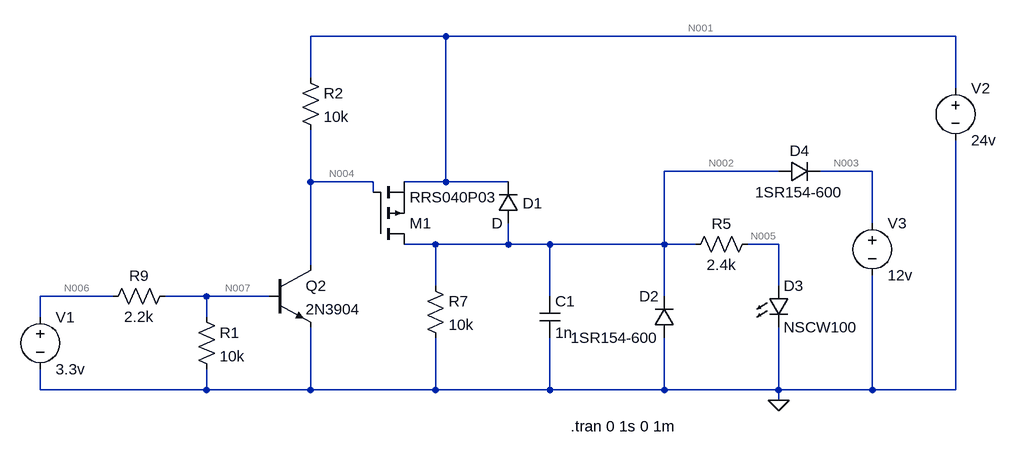
[diagram p0: schematic Prob 3_Before.asc]
Prob 3_Before.asc, the LTspice schematic file:
Version 4
SHEET 1 1096 680
WIRE 176 -112 -32 -112
WIRE 960 -112 176 -112
WIRE -32 -48 -32 -112
WIRE 960 -32 960 -112
WIRE 688 96 512 96
WIRE 832 96 752 96
WIRE -32 112 -32 32
WIRE 64 112 -32 112
WIRE 176 112 176 -112
WIRE 176 112 112 112
WIRE 272 112 176 112
WIRE 64 128 64 112
WIRE 832 176 832 96
WIRE 160 208 112 208
WIRE 272 208 272 176
WIRE 272 208 160 208
WIRE 336 208 272 208
WIRE 512 208 512 96
WIRE 512 208 336 208
WIRE 560 208 512 208
WIRE 688 208 640 208
WIRE -32 240 -32 112
WIRE 160 272 160 208
WIRE 688 272 688 208
WIRE -336 288 -448 288
WIRE -192 288 -256 288
WIRE -96 288 -192 288
WIRE 336 288 336 208
WIRE 512 288 512 208
WIRE -448 320 -448 288
WIRE -192 320 -192 288
WIRE -448 432 -448 400
WIRE -192 432 -192 400
WIRE -192 432 -448 432
WIRE -32 432 -32 336
WIRE -32 432 -192 432
WIRE 160 432 160 352
WIRE 160 432 -32 432
WIRE 336 432 336 352
WIRE 336 432 160 432
WIRE 512 432 512 352
WIRE 512 432 336 432
WIRE 688 432 688 336
WIRE 688 432 512 432
WIRE 832 432 832 256
WIRE 832 432 688 432
WIRE 960 432 960 48
WIRE 960 432 832 432
WIRE 688 448 688 432
FLAG 688 448 0
SYMBOL res -48 -64 R0
SYMATTR InstName R2
SYMATTR Value 10k
SYMBOL res 656 192 R90
WINDOW 0 0 56 VBottom 2
WINDOW 3 32 56 VTop 2
SYMATTR InstName R5
SYMATTR Value 2.4k
SYMBOL voltage -448 304 R0
WINDOW 123 0 0 Left 0
WINDOW 39 0 0 Left 0
SYMATTR InstName V1
SYMATTR Value 3.3v
SYMBOL voltage 960 -48 R0
WINDOW 123 0 0 Left 0
WINDOW 39 0 0 Left 0
SYMATTR InstName V2
SYMATTR Value 24v
SYMBOL voltage 832 160 R0
WINDOW 123 0 0 Left 0
WINDOW 39 0 0 Left 0
SYMATTR InstName V3
SYMATTR Value 12v
SYMBOL pmos 64 208 M180
SYMATTR InstName M1
SYMATTR Value RRS040P03
SYMBOL res 144 256 R0
SYMATTR InstName R7
SYMATTR Value 10k
SYMBOL npn -96 240 R0
SYMATTR InstName Q2
SYMATTR Value 2N3904
SYMBOL diode 288 176 R180
WINDOW 0 -37 31 Left 2
WINDOW 3 24 0 Left 2
SYMATTR InstName D1
SYMBOL res -208 304 R0
SYMATTR InstName R1
SYMATTR Value 10k
SYMBOL res -240 272 R90
WINDOW 0 0 56 VBottom 2
WINDOW 3 32 56 VTop 2
SYMATTR InstName R9
SYMATTR Value 2.2k
SYMBOL cap 320 288 R0
SYMATTR InstName C1
SYMATTR Value 1n
SYMBOL diode 528 352 R180
WINDOW 0 24 64 Left 2
WINDOW 3 24 0 Left 2
SYMATTR InstName D2
SYMATTR Value 1SR154-600
SYMBOL LED 672 272 R0
SYMATTR InstName D3
SYMATTR Value NSCW100
SYMBOL diode 688 112 R270
WINDOW 0 32 32 VTop 2
WINDOW 3 0 32 VBottom 2
SYMATTR InstName D4
SYMATTR Value 1SR154-600
TEXT 368 488 Left 2 !.tran 0 1s 0 1m

The netlist it stands for:
* Prob 3_Before.asc
R2 N001 N004 10k
R5 N005 N002 2.4k
V1 N006 0 3.3v
V2 N001 0 24v
V3 N003 0 12v
M1 N002 N004 N001 N001 RRS040P03
R7 N002 0 10k
Q2 N004 N007 0 0 2N3904
D1 N002 N001 D
R1 N007 0 10k
R9 N007 N006 2.2k
C1 N002 0 1n
D2 0 N002 1SR154-600
D3 N005 0 NSCW100
D4 N002 N003 1SR154-600
.model D D
.lib standard.dio
.model NPN NPN
.model PNP PNP
.lib standard.bjt
.model NMOS NMOS
.model PMOS PMOS
.lib standard.mos
.tran 0 1s 0 1m
.backanno
.end

* Results of the author's LTspice run, read from the files saved beside the schematic
* Operating Point, zero values left out:
*   V(n001) = 24 V
*   V(n004) = 16.25 mV
*   V(n005) = 3.259 V
*   V(n002) = 19.07 V
*   V(n006) = 3.3 V
*   V(n003) = 12 V
*   V(n007) = 730.6 mV
*   Ic(Q2) = 2.398 mA
*   Ib(Q2) = 1.095 mA
*   Ie(Q2) = -3.493 mA
*   Id(M1) = -102.7 A
*   Is(M1) = 102.7 A
*   I(D3) = 6.589 mA
*   I(D4) = 102.7 A
*   I(D2) = -7.78 nA
*   I(D1) = -4.936 pA
*   I(R9) = -1.168 mA
*   I(R1) = 73.06 µA
*   I(R7) = 1.907 mA
*   I(R5) = -6.589 mA
*   I(R2) = 2.398 mA
*   I(V3) = 102.7 A
*   I(V2) = -102.7 A
*   I(V1) = -1.168 mA